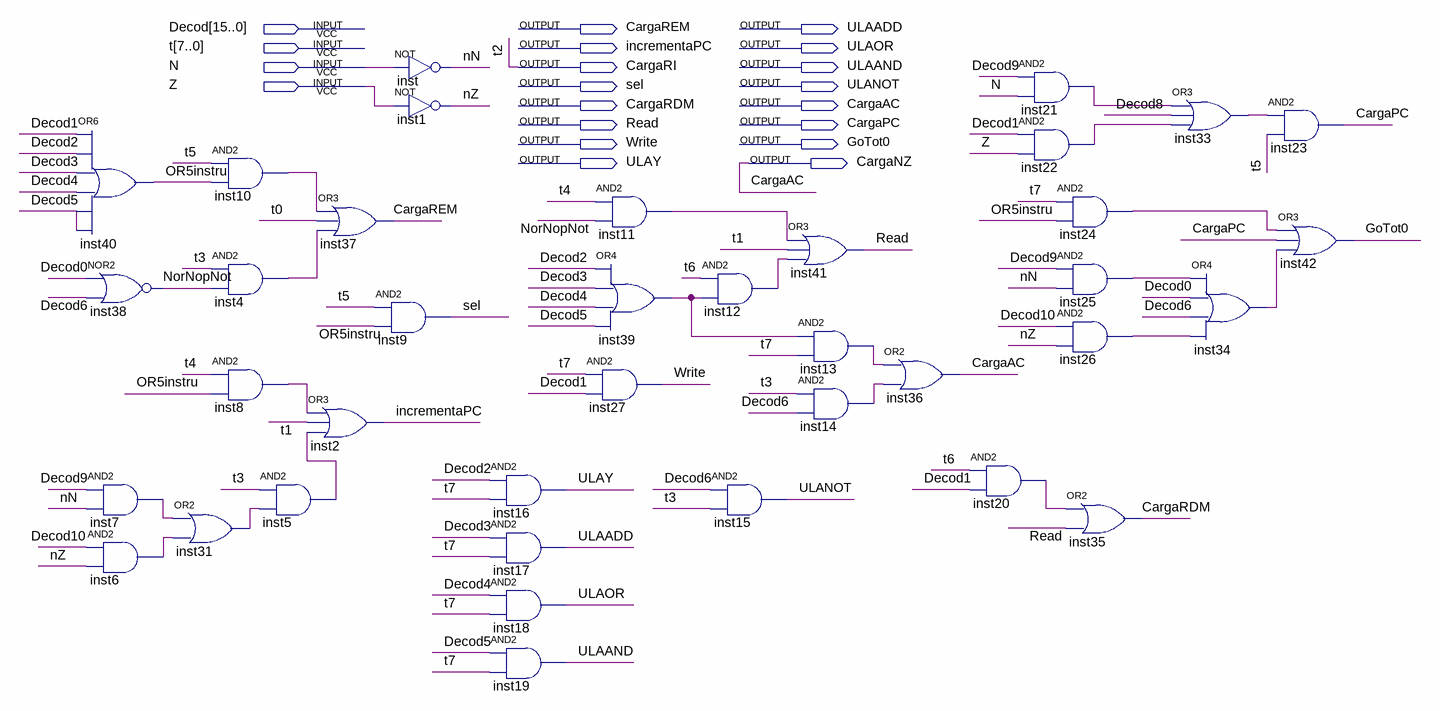
[diagram p0: schematic sheet]
// Quartus schematic UnidadadeDeControle.bdf as structural Verilog: 38 symbols, 20 pins
module UnidadadeDeControle (
  input  [15:0] Decod,
  input  [7:0] t,
  input  N,
  input  Z,
  output CargaREM,
  output ULAADD,
  output incrementaPC,
  output ULAOR,
  output CargaRI,
  output ULAAND,
  output sel,
  output ULANOT,
  output CargaRDM,
  output CargaAC,
  output Read,
  output CargaPC,
  output Write,
  output GoTot0,
  output ULAY,
  output CargaNZ
);

  wire inst4_out, inst5_out, inst6_out, inst7_out, inst8_out, inst10_out, inst11_out, inst12_out, inst13_out,
       inst14_out, inst20_out, inst21_out, inst22_out, inst24_out, inst25_out, inst26_out, inst31_out,
       inst33_out, inst34_out, inst39_out, nN, NorNopNot, nZ, OR5instru;

  or inst40 (OR5instru, Decod[1], Decod[2], Decod[3], Decod[4], Decod[5], Decod[5]);
  nor inst38 (NorNopNot, Decod[0], Decod[6]);
  and inst7 (inst7_out, Decod[9], nN);
  and inst6 (inst6_out, Decod[10], nZ);
  or inst31 (inst31_out, inst7_out, inst6_out);
  and inst10 (inst10_out, t[5], OR5instru);
  and inst4 (inst4_out, t[3], NorNopNot);
  and inst8 (inst8_out, t[4], OR5instru);
  and inst5 (inst5_out, t[3], inst31_out);
  or inst37 (CargaREM, inst10_out, t[0], inst4_out);
  or inst2 (incrementaPC, inst8_out, t[1], inst5_out);
  not inst (nN, N);
  not inst1 (nZ, Z);
  and inst9 (sel, t[5], OR5instru);
  and inst16 (ULAY, Decod[2], t[7]);
  and inst17 (ULAADD, Decod[3], t[7]);
  and inst18 (ULAOR, Decod[4], t[7]);
  and inst19 (ULAAND, Decod[5], t[7]);
  and inst27 (Write, t[7], Decod[1]);
  and inst11 (inst11_out, t[4], NorNopNot);
  or inst39 (inst39_out, Decod[2], Decod[3], Decod[4], Decod[5]);
  and inst12 (inst12_out, t[6], inst39_out);
  and inst15 (ULANOT, Decod[6], t[3]);
  or inst41 (Read, inst11_out, t[1], inst12_out);
  and inst13 (inst13_out, inst39_out, t[7]);
  and inst14 (inst14_out, t[3], Decod[6]);
  or inst36 (CargaAC, inst13_out, inst14_out);
  and inst20 (inst20_out, t[6], Decod[1]);
  and inst21 (inst21_out, Decod[9], N);
  and inst22 (inst22_out, Decod[1], Z);
  and inst24 (inst24_out, t[7], OR5instru);
  and inst25 (inst25_out, Decod[9], nN);
  and inst26 (inst26_out, Decod[10], nZ);
  or inst35 (CargaRDM, inst20_out, Read);
  or inst33 (inst33_out, inst21_out, Decod[8], inst22_out);
  or inst34 (inst34_out, inst25_out, Decod[0], Decod[6], inst26_out);
  and inst23 (CargaPC, inst33_out, t[5]);
  or inst42 (GoTot0, inst24_out, CargaPC, inst34_out);

  assign CargaNZ = CargaAC;
  assign CargaRI = t[2];
endmodule
